# Altium schematic sheet dht_bme280.SchDoc
size A
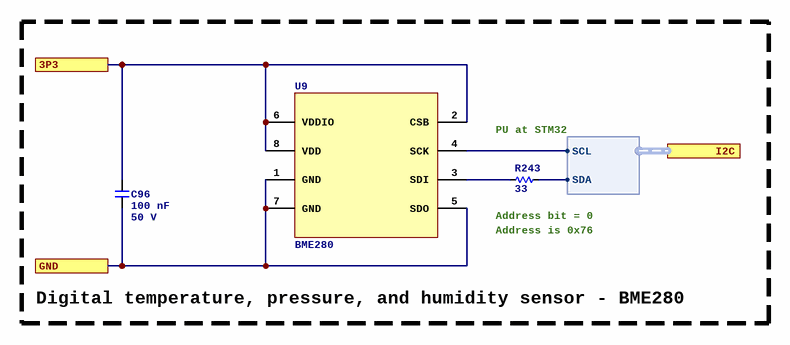
[diagram p0: dht_bme280.SchDoc]

## Parts
C96  Capacitance: 100 nF  Voltage Rating: 50 V  [C0402]  (hidden comment: CL05B104KB54PNC)
R243  value 33  [R0402]  (hidden comment: 0402WGF330JTCE)
U9  BME280  [BOSCH_BME280]

## Blocks framed on the sheet
Digital temperature, pressure, and humidity sensor - BME280: C96 R243 U9

## Ports
3P3, GND, I2C (harness I2C)

## Harnesses
I2C: SCL, SDA

## Nets
3P3: C96.1 U9.2(CSB) U9.6(VDDIO) U9.8(VDD) ; port 3P3
GND: C96.2 U9.1(GND) U9.5(SDO) U9.7(GND) ; port GND
NetR243_1: R243.1 ; port I2C.SDA
NetR243_2: R243.2 U9.3(SDI)
NetU9_4: U9.4(SCK) ; port I2C.SCL

## Notes on the sheet
- PU at STM32
- Address is 0x76
- (near R243) Address bit = 0

## Library data of the parts
C96 = CL05B104KB54PNC: Manufacturer: Samsung Electro-Mechanics; Dielectric: X7R; ComponentLink1URL: https://wmsc.lcsc.com/wmsc/upload/file/pdf/v2/lcsc/2304140030_Samsung-Electro-Mechanics-CL05B104KB54PNC_C307331.pdf; ComponentLink1Description: Datasheet; Manufacturer Part Number: CL05B104KB54PNC; Package: 0402; Supplier 2: LCSC; Supplier Part Number 2: C307331
R243 = 0402WGF330JTCE: Manufacturer: UNI-ROYAL(Uniroyal Elec); Tolerance: 1%; Temperature Coefficient: ±100ppm/?; Power Rating (mW): 62.5; ComponentLink1Description: Datasheet; ComponentLink1URL: https://wmsc.lcsc.com/wmsc/upload/file/pdf/v2/lcsc/2205311900_UNI-ROYAL-Uniroyal-Elec-0402WGF330JTCE_C25105.pdf; Manufacturer Part Number: 0402WGF330JTCE; Package: 0402; Supplier 2: LCSC; Supplier Part Number 2: C25105
U9 = BME280: Pressure, Temperature and Humidity Sensor Digital Output 1.8V 8-Pin LGA T/R; Manufacturer: Bosch Tools; Supplier 1: DigiKey; Supplier Part Number 1: 828-1063-1-ND; Manufacturer Part Number: BME280; ComponentLink1Description: Datasheet; ComponentLink1URL: https://www.bosch-sensortec.com/media/boschsensortec/downloads/datasheets/bst-bme280-ds002.pdf; Supplier 2: LCSC; Supplier Part Number 2: C92489; Supplier 3: Mouser; Supplier Part Number 3: 262-BME280